# EAGLE design usb (EAGLE 9.0.1)
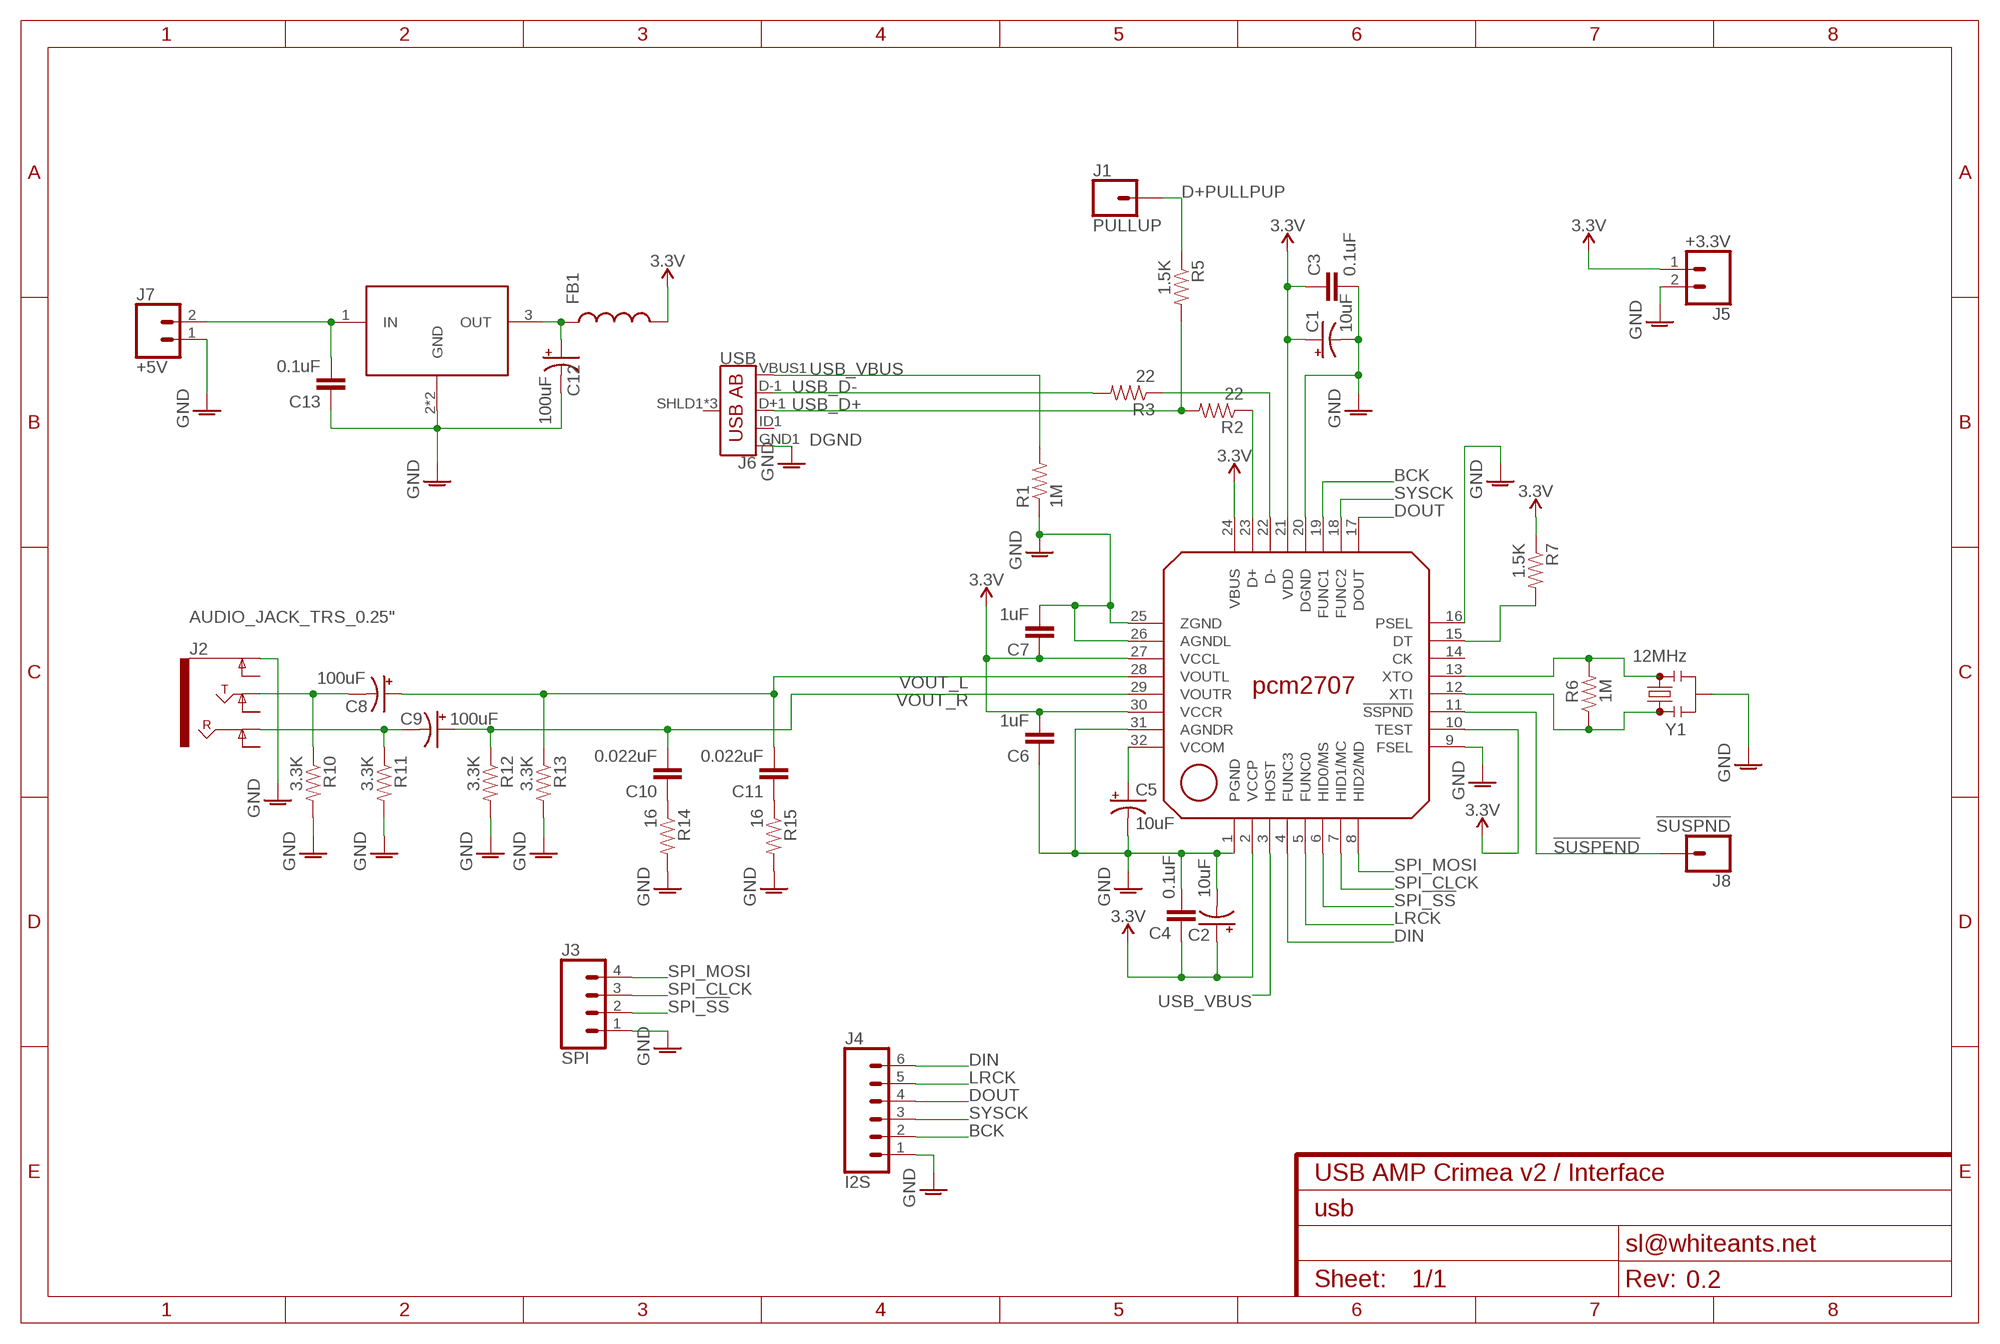
[diagram p0: schematic, sheet 1]
PCM2707_FRAME (FRAME-A4L): CNAME: USB AMP Crimea v2 / Interface; CREVISION: 0.2; DESIGNER: sl@whiteants.net

## Parts
C1  10uF  CAP_POLPTH1  [CPOL-RADIAL-100UF-25V]
C2  10uF  CAP_POLPTH1  [CPOL-RADIAL-100UF-25V]
C3  0.1uF  CAP1206  [1206]
C4  0.1uF  CAP1206  [1206]
C5  10uF  CAP_POLPTH1  [CPOL-RADIAL-100UF-25V]
C6  1uF  CAP1206  [1206]
C7  1uF  CAP1206  [1206]
C8  100uF  CAP_POLPTH1  [CPOL-RADIAL-100UF-25V]
C9  100uF  CAP_POLPTH1  [CPOL-RADIAL-100UF-25V]
C10  0.022uF  CAP1206  [1206]
C11  0.022uF  CAP1206  [1206]
C12  100uF  CAP_POLPTH1  [CPOL-RADIAL-100UF-25V]
C13  0.1uF  CAP1206  [1206]
FB1  INDUCTOR1210  [1210]
J1  PULLUP  CONN_01  [1X01]
J2  AUDIO_JACK_TRS_0.25"  AUDIO_JACK_TRS_0.25"_PTH_RA  [AUDIO_JACK_0.25"_TRS_PTH_RA]
J3  SPI  CONN_04  [1X04]
J4  I2S  CONN_06POLAR  [MOLEX-1X6]
J5  +3.3V  CONN_02LOCK_LONGPADS  [1X02_LOCK_LONGPADS]
J6  USB  USB_AB_SMT  [USB-AB-MICRO-SMD]
J7  +5V  CONN_02LOCK_LONGPADS  [1X02_LOCK_LONGPADS]
J8  !SUSPND!  CONN_01  [1X01]
R1  1M  RESISTOR0805-RES  [0805]
R2  22  RESISTOR0805-RES  [0805]
R3  22  RESISTOR0805-RES  [0805]
R5  1.5K  RESISTOR0805-RES  [0805]
R6  1M  RESISTOR0805-RES  [0805]
R7  1.5K  RESISTOR0805-RES  [0805]
R10  3.3K  RESISTOR0805-RES  [0805]
R11  3.3K  RESISTOR0805-RES  [0805]
R12  3.3K  RESISTOR0805-RES  [0805]
R13  3.3K  RESISTOR0805-RES  [0805]
R14  16  RESISTOR0805-RES  [0805]
R15  16  RESISTOR0805-RES  [0805]
U2  LM3940IMP-3.3  LM3940IMP-3.3/NOPB  [SOT223]
UK1  PCM2707  [TQFP32-0.8-7X7MM]
Y1  12MHz  RESONATORSMD-3.2X1.3  [RESONATOR-SMD-3.2X1.3]

## Nets
3.3V: C1.1(+) C2.1(+) C3.1 C4.1 C6.2 C7.1 FB1.2 J5.1 R7.1 UK1.2(VCCP) UK1.10(TEST) UK1.21(VDD) UK1.24(VBUS) UK1.27(VCCL) UK1.30(VCCR)
!SUSPEND!: J8.1 UK1.11(!SSPND!)
+5V: C13.2 J7.2 U2.1(IN)
BCK: J4.2 UK1.19(FUNC1)
D+PULLPUP: J1.1 R5.1
DGND: C1.2(-) C2.2(-) C3.2 C4.2 C5.2(-) C6.1 C7.2 C12.2(-) C13.1 J2.SLEEVE(EARTH) J3.1 J4.1 J5.2 J6.GND1(GND) J7.1 R1.1 R10.2 R11.2 R12.2 R13.2 R14.2 R15.2 U2.2(GND) U2.4(GND) UK1.1(PGND) UK1.9(FSEL) UK1.16(PSEL) UK1.20(DGND) UK1.25(ZGND) UK1.26(AGNDL) UK1.31(AGNDR) Y1.2 ; supply symbol labelled GND
DIN: J4.6 UK1.4(FUNC3)
DOUT: J4.4 UK1.17(DOUT)
LRCK: J4.5 UK1.5(FUNC0)
N$1: R6.1 UK1.12(XTI) Y1.1
N$2: C12.1(+) FB1.1 U2.3(OUT)
N$3: R6.2 UK1.13(XTO) Y1.3
N$4: R2.1 UK1.23(D+)
N$5: R3.1 UK1.22(D-)
N$6: C5.1(+) UK1.32(VCOM)
N$7: R7.2 UK1.15(DT)
N$10: C8.2(-) J2.TIP R10.1
N$11: C9.2(-) J2.RING R11.1
N$14: C10.1 R14.1
N$15: C11.1 R15.1
SPI_!SS!: J3.2 UK1.6(HID0/MS)
SPI_CLCK: J3.3 UK1.7(HID1/MC)
SPI_MOSI: J3.4 UK1.8(HID2/MD)
SYSCK: J4.3 UK1.18(FUNC2)
USB_D+: J6.D+1(D+) R2.2 R5.2
USB_D-: J6.D-1(D-) R3.2
USB_VBUS: J6.VBUS1(VBUS) R1.2 UK1.3(HOST)
VOUT_L: C8.1(+) C11.2 R13.1 UK1.28(VOUTL)
VOUT_R: C9.1(+) C10.2 R12.1 UK1.29(VOUTR)
Unconnected: J2.RING-NORM J2.SLEEVE-NORM(EARTH-NORM) J2.TIP-NORM J6.ID1(USBID) J6.SHLD1(SHIELD) J6.SHLD2(SHIELD) J6.SHLD3(SHIELD) UK1.14(CK)

## Library data of the parts
C1 C2 C5 C8 C9 C12 = SparkFun-Passives:CAP_POL: Capacitor Polarized These are standard SMD and PTH capacitors. Normally 10uF, 47uF, and 100uF in electrolytic and tantalum varieties. Always verify the external diameter of the through hole cap, it varies with capacity, voltage, and manufacturer. The EIA devices should be standard.
C3 C4 C6 C7 C10 C11 C13 = SparkFun-Passives:CAP: Capacitor Standard 0603 ceramic capacitor, and 0.1" leaded capacitor.
FB1 = SparkFun-Passives:INDUCTOR: Inductors Basic Inductor/Choke - 0603 and 1206. Footprints are not proven and vary greatly between part numbers. INDUCTOR POWER 3.3UH 4.0A SMD 0.197" L x 0.197" W x 0.177" H (5.00mm x 5.00mm x 4.50mm)
J1 J8 = SparkFun-Connectors:CONN_01: Single connection point. Often used as Generic Header-pin footprint for 0.1 inch spaced/style header connections On any of the 0.1 inch spaced packages, you can populate with these: Break Away Headers - Straight <https://www.sparkfun.com/products/116> (PRT-00116) Break Away Male Headers - Right Angle <https://www.sparkfun.com/products/553> (PRT-00553) Female Headers <https://www.sparkfun.com/products/115> (PRT-00115) Break Away Headers - Machine Pin <https://www.sparkfun.com/products/117> (PRT-00117) Break Away Female Headers - Swiss Machine Pin <https://www.sparkfun.com/products/743> (PRT-00743) This device is also useful as a general connection point to wire up your design to another part of your project. Our various solder wires solder well into these plated through hole pads. Hook-Up Wire - Assortment (Stranded, 22 AWG) <https://www.sparkfun.com/products/11375> (PRT-11375) Hook-Up Wire - Assortment (Solid Core, 22 AWG) <https://www.sparkfun.com/products/11367> (PRT-11367) View the entire wire category on our website here <https://www.sparkfun.com/categories/141> Special notes: SMTSO-256-ET is a "flush mount" nut for a 4-40 screw. We mostly use this on specialty testbeds; it is a nice way to connect hardware to your PCB at an adjustable hieght. Also note, the SNAP packages are for using a snappable style connector. We sell a baggie of snaps and they are also used on two LilyPad designs: Snap Assortment - 30 pack (male and female) <https://www.sparkfun.com/products/11347> (DEV-11347) LilyPad Arduino SimpleSnap <https://www.sparkfun.com/products/10941> (DEV-10941) LilyPad SimpleSnap Protoboard <https://www.sparkfun.com/products/10940> (DEV-10940)
J2 = SparkFun-Connectors:AUDIO_JACK_TRS_0.25"_PTH_RA: Audio Jack, 1/4" TRS jack, horizontal, PTH, aka "Phono jack" Find the connector here: Audio Jack - 1/4" Stereo (right angle) <https://www.sparkfun.com/products/11144> (COM-11144) Datasheet <http://cdn.sparkfun.com/datasheets/Components/General/JP-611%20DD.jpg> Note, although the datasheet and physical part are slightly different, this footprint was proven to mate well on the Proto Pedal. This device is used on these SparkFun Products: SparkFun TRS Jack Breakout - 1/4" Stereo <https://www.sparkfun.com/products/13005> (BOB-13005 ) SparkFun Proto Pedal - sorry bad link - product comming soon! <https://www.sparkfun.com/products/13124> (PRT-13124); PROD_ID: CONN-12339; SF_ID: COM-11144
J3 = SparkFun-Connectors:CONN_04: Multi connection point. Often used as Generic Header-pin footprint for 0.1 inch spaced/style header connections On any of the 0.1 inch spaced packages, you can populate with these: Break Away Headers - Straight <https://www.sparkfun.com/products/116> (PRT-00116) Break Away Male Headers - Right Angle <https://www.sparkfun.com/products/553> (PRT-00553) Female Headers <https://www.sparkfun.com/products/115> (PRT-00115) Break Away Headers - Machine Pin <https://www.sparkfun.com/products/117> (PRT-00117) Break Away Female Headers - Swiss Machine Pin <https://www.sparkfun.com/products/743> (PRT-00743) For SCREWTERMINALS and SPRING TERMINALS visit here: Screw Terimnals on SparkFun.com <https://www.sparkfun.com/search/results?term=Screw+Terminals> (5mm/3.5mm/2.54mm spacing) This device is also useful as a general connection point to wire up your design to another part of your project. Our various solder wires solder well into these plated through hole pads. Hook-Up Wire - Assortment (Stranded, 22 AWG) <https://www.sparkfun.com/products/11375> (PRT-11375) Hook-Up Wire - Assortment (Solid Core, 22 AWG) <https://www.sparkfun.com/products/11367> (PRT-11367) View the entire wire category on our website here <https://www.sparkfun.com/categories/141> Special notes: Molex polarized connector foot print use with SKU : PRT-08231 with associated crimp pins and housings. 1MM SMD Version SKU: PRT-10208; PROD_ID: CONN-09696
J4 = SparkFun-Connectors:CONN_06: Multi connection point. Often used as Generic Header-pin footprint for 0.1 inch spaced/style header connections On any of the 0.1 inch spaced packages, you can populate with these: Break Away Headers - Straight <https://www.sparkfun.com/products/116> (PRT-00116) Break Away Male Headers - Right Angle <https://www.sparkfun.com/products/553> (PRT-00553) Female Headers <https://www.sparkfun.com/products/115> (PRT-00115) Break Away Headers - Machine Pin <https://www.sparkfun.com/products/117> (PRT-00117) Break Away Female Headers - Swiss Machine Pin <https://www.sparkfun.com/products/743> (PRT-00743) Arduino Stackable Header - 6 Pin <https://www.sparkfun.com/products/9280> (PRT-09280) For SCREWTERMINALS and SPRING TERMINALS visit here: Screw Terimnals on SparkFun.com <https://www.sparkfun.com/search/results?term=Screw+Terminals> (5mm/3.5mm/2.54mm spacing) This device is also useful as a general connection point to wire up your design to another part of your project. Our various solder wires solder well into these plated through hole pads. Hook-Up Wire - Assortment (Stranded, 22 AWG) <https://www.sparkfun.com/products/11375> (PRT-11375) Hook-Up Wire - Assortment (Solid Core, 22 AWG) <https://www.sparkfun.com/products/11367> (PRT-11367) View the entire wire category on our website here <https://www.sparkfun.com/categories/141>
J5 J7 = SparkFun-Connectors:CONN_02: Multi connection point. Often used as Generic Header-pin footprint for 0.1 inch spaced/style header connections On any of the 0.1 inch spaced packages, you can populate with these: Break Away Headers - Straight <https://www.sparkfun.com/products/116> (PRT-00116) Break Away Male Headers - Right Angle <https://www.sparkfun.com/products/553> (PRT-00553) Female Headers <https://www.sparkfun.com/products/115> (PRT-00115) Break Away Headers - Machine Pin <https://www.sparkfun.com/products/117> (PRT-00117) Break Away Female Headers - Swiss Machine Pin <https://www.sparkfun.com/products/743> (PRT-00743) For SCREWTERMINALS and SPRING TERMINALS visit here: Screw Terimnals on SparkFun.com <https://www.sparkfun.com/search/results?term=Screw+Terminals> (5mm/3.5mm/2.54mm spacing) This device is also useful as a general connection point to wire up your design to another part of your project. Our various solder wires solder well into these plated through hole pads. Hook-Up Wire - Assortment (Stranded, 22 AWG) <https://www.sparkfun.com/products/11375> (PRT-11375) Hook-Up Wire - Assortment (Solid Core, 22 AWG) <https://www.sparkfun.com/products/11367> (PRT-11367) View the entire wire category on our website here <https://www.sparkfun.com/categories/141> Special notes: Molex polarized connector foot print use with: PRT-08233 with associated crimp pins and housings. 2.54_SCREWTERM for use with PRT-10571. 3.5mm Screw Terminal footprints for PRT-08084 5mm Screw Terminal footprints for use with PRT-08432
J6 = SparkFun-Connectors:USB_AB: USB Type AB Micro Connector OTG-compatible. 5 pins, 3 shield pins SparkFun Products: IOIO-OTG <https://www.sparkfun.com/products/13613> SparkFun SAMD21 Mini Breakout <https://www.sparkfun.com/products/13664>; PROD_ID: CONN-11794
R1-R3 R5-R7 R10-R15 = SparkFun-Passives:RESISTOR: Resistor Basic schematic elements and footprints for 0603, 1206, and PTH resistors.
U2 = EduAreaLib:LM3940IMP-3.3/NOPB
UK1 = EduAreaLib:PCM2707; SPICEPREFIX: U
Y1 = SparkFun-Clocks:RESONATOR: Resonators (Generic) Ceramic resonators are clock-generating components, often used to control timing in microcontrollers. They usually have 3 pins: two pins for oscillation, and one pin for ground. Compared to crystals, resonators have worse tolerance, but are usually much cheaper. Plus, they have built-in load capacitors! These devices are used on boards like the Arduino Pro 8MHz <https://www.sparkfun.com/products/11114> and Arduino Pro 16MHz <https://www.sparkfun.com/products/11113>.

## Board
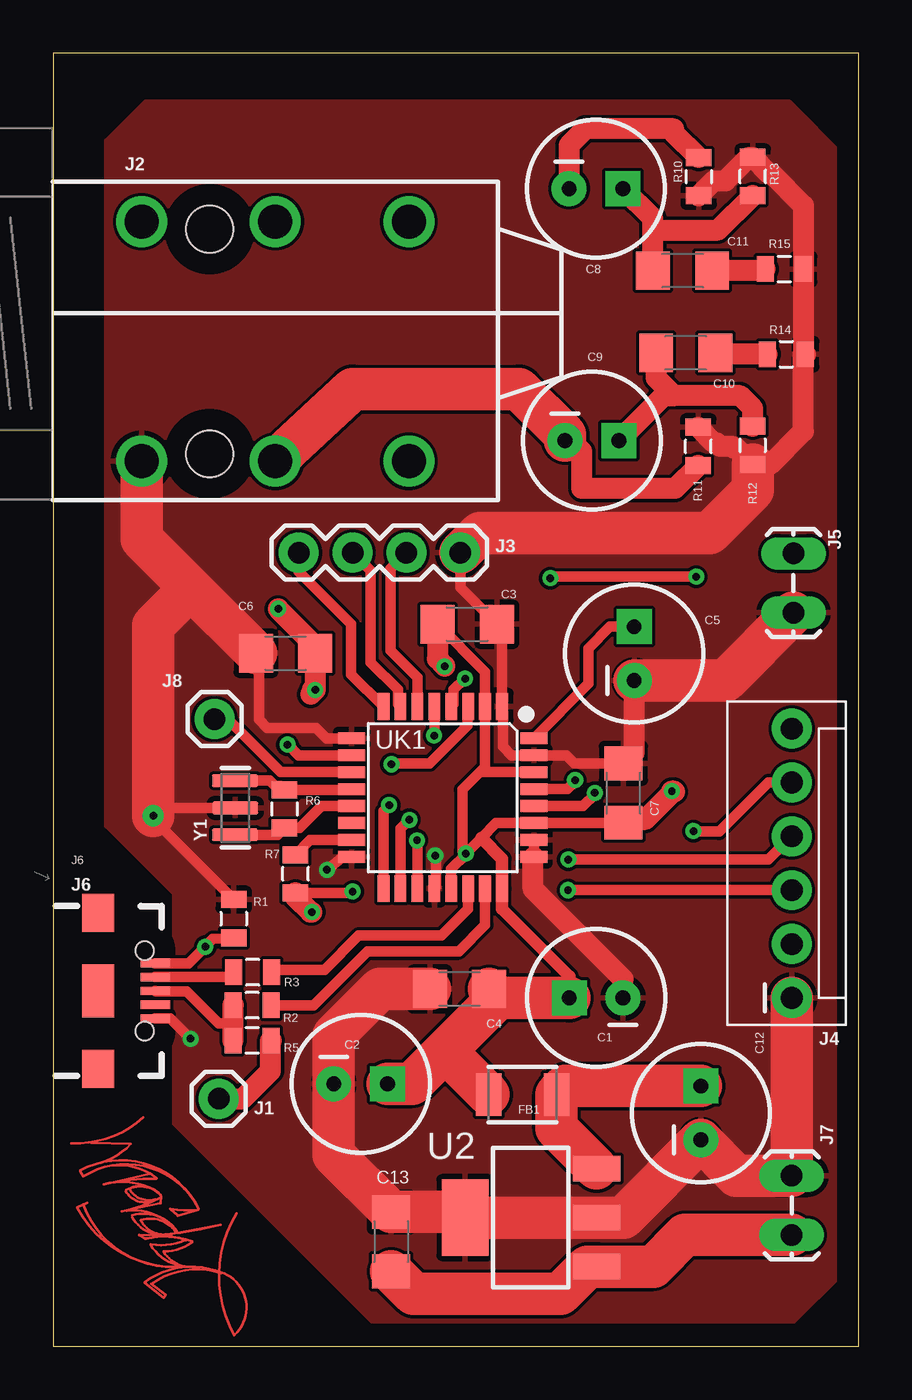
[diagram p1: board, top side]
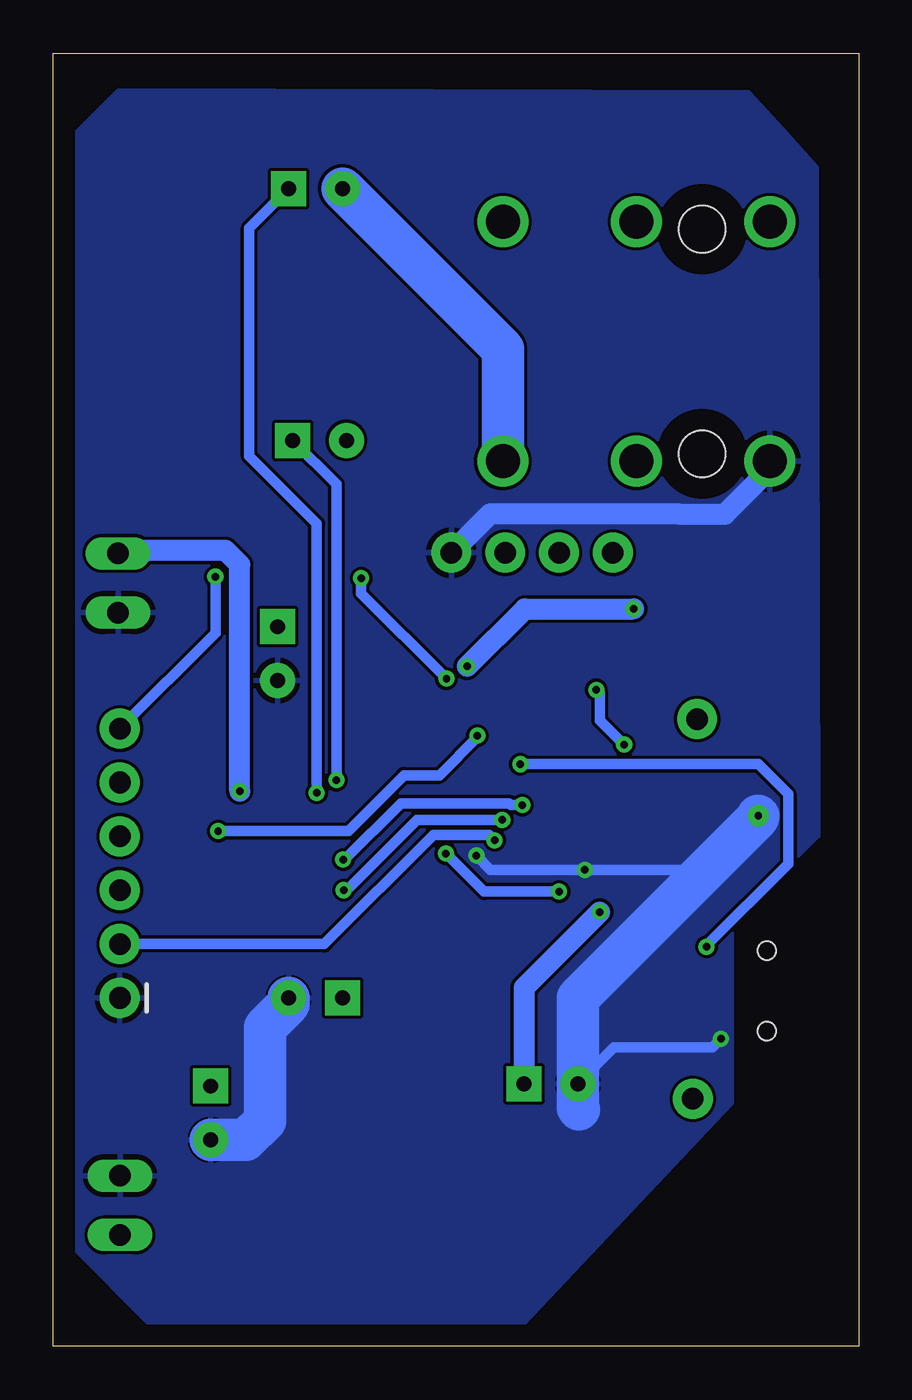
[diagram p2: board, bottom side, seen from below]

Size 38 x 61 mm. Coordinates in mm from the lower left corner, seen from the top.
Outline: 0,0 38,0 38,61 0,61 0,0
Copper layers (1*16): Top 0.035mm / dielectric 1.6mm / Bottom 0.035mm
Design rules "default *": minimum track width 6mil, minimum drill 0.35mm, track to track 6mil, track to pad 6mil, pad to pad 6mil, via to via 6mil, smd to smd 6mil, copper to edge 40mil, drill to drill 6mil, minimum pad ring 10mil, minimum via ring 8mil, stop-mask expansion 4mil, vias tented up to drill 0mil, thermal gap 10mil

### Footprints (pad centres in the part's own frame; a part is rotated, then mirrored left to right if it is on the bottom)
CPOL-RADIAL-100UF-25V = drill 0.7 pad 1.651 square: 1 1.27,0 | drill 0.7 pad 1.651: 2 -1.27,0
1206 = smd 1.6 x 1.8: 1 -1.4,0; 2 1.4,0
1210 = smd 1.2 x 2: 1 -1.6,0; 2 1.6,0
1X01 = drill 1.016 pad 1.88: 1 0,0
AUDIO_JACK_0.25"_TRS_PTH_RA = drill 1.6: RING 10.5,-6.95; RING-NORM 10.5,4.35; SLEEVE 4.2,-6.95; SLEEVE-NORM 4.2,4.35; TIP 16.8,-6.95; TIP-NORM 16.8,4.35 | hole 2.2: 7.4,4; 7.4,-6.6
1X04 = drill 1.016 pad 1.88: 1 0,0; 2 2.54,0; 3 5.08,0; 4 7.62,0
MOLEX-1X6 = drill 1.016 pad 1.88: 1 0,0; 2 2.54,0; 3 5.08,0; 4 7.62,0; 5 10.16,0; 6 12.7,0
1X02_LOCK_LONGPADS = drill 1.016 long: 1 -0.127,0; 2 2.667,0
USB-AB-MICRO-SMD = smd 1.4 x 0.4: D+1 2.7,0; D-1 2.7,0.65; GND1 2.7,-1.3; ID1 2.7,-0.65; VBUS1 2.7,1.3 | smd 1.5 x 1.8: SHLD1 0,-3.68; SHLD2 0,3.68 | smd 1.5 x 2.5: SHLD3 0,0 | hole 0.85: 2.2,1.9; 2.2,-1.9
0805 = smd 0.8 x 1.2: 1 -0.9,0; 2 0.9,0
SOT223 = smd 1.219 x 2.235: 1 -2.311,-3.099; 2 0,-3.099; 3 2.311,-3.099 | smd 3.6 x 2.2: 4 0,3.099
TQFP32-0.8-7X7MM = smd 1.27 x 0.559: 1 -4.293,2.8; 2 -4.293,2; 3 -4.293,1.2; 4 -4.293,0.4; 5 -4.293,-0.4; 6 -4.293,-1.2; 7 -4.293,-2; 8 -4.293,-2.8; 17 4.293,-2.8; 18 4.293,-2; 19 4.293,-1.2; 20 4.293,-0.4; 21 4.293,0.4; 22 4.293,1.2; 23 4.293,2; 24 4.293,2.8 | smd 0.559 x 1.27: 9 -2.8,-4.293; 10 -2,-4.293; 11 -1.2,-4.293; 12 -0.4,-4.293; 13 0.4,-4.293; 14 1.2,-4.293; 15 2,-4.293; 16 2.8,-4.293; 25 2.8,4.293; 26 2,4.293; 27 1.2,4.293; 28 0.4,4.293; 29 -0.4,4.293; 30 -1.2,4.293; 31 -2,4.293; 32 -2.8,4.293
RESONATOR-SMD-3.2X1.3 = smd 0.61 x 2.184: 1 -1.283,-0.006; 2 0,0; 3 1.27,-0.006

### Placement (x,y rotation side)
C1  25.62,16.44 180 top
C2  14.52,12.39 0 top
C3  19.54,34.06 0 top
C4  19.17,16.86 180 top
C5  27.41,32.67 90 top
C6  10.97,32.69 0 top
C7  26.91,26.1 90 top
C8  25.61,54.61 0 top
C9  25.43,42.73 0 top
C10  29.85,46.86 180 top
C11  29.69,50.74 180 top
C12  30.56,11.01 90 top
C13  15.95,4.94 270 top
FB1  22.15,11.88 180 top
J1  7.82,11.68 0 top
J2  -0.02,48.7 0 top
J3  19.21,37.44 180 top
J4  34.85,16.44 90 top
J5  34.93,37.27 270 top
J6  2.13,16.77 0 top
J7  34.84,7.93 270 top
J8  7.62,29.59 0 top
R1  8.53,20.18 270 top
R2  9.4,16.09 180 top
R3  9.41,17.65 180 top
R5  9.39,14.43 180 top
R6  10.92,25.36 270 top
R7  11.44,22.29 90 top
R10  30.46,55.16 270 top
R11  30.43,42.45 90 top
R12  33,42.5 270 top
R13  33,55.18 90 top
R14  34.59,46.79 0 top
R15  34.49,50.81 0 top
U2  22.54,6.08 90 top
U$3  [CRIMEA_TOP]  8.56,3.09 115 top
UK1  18.38,25.88 270 top
Y1  8.59,25.4 270 top

### Tracks (layer width: path | path; a pad name or v marks a point on that pad's centre or on a via)
3.3V  (via drill 0.35)
  Top 0.5: UK1.21 18.78,22.52 19.47,23.21 | 19.47,23.21 v19.47,23.25 20.2,23.98 20.9,24.68 UK1.27 26.89,24.68 C7.1 | C3.1 20.38,31.82 UK1.2 20.38,27.33 20.13,27.08 | R7.1 14.02,21.39 14.13,21.5 | 14.21,21.58 14.13,21.5 | 14.13,21.5 v14.13,21.45 | UK1.30 20.13,27.08 | 20.13,27.08 19.31,26.26 19.31,23.37 19.47,23.21 | v11.06,28.38 11.09,28.38 11.59,27.88 UK1.10
  Top 0.6: 20.2,23.98 21.18,23 UK1.24 21.18,20.63 24.35,17.46 C1.1
  Top 1: v12.37,30.97 C6.2 12.37,33.04 v10.62,34.79 | v12.37,30.97 12.15,30.75 | 12.24,30.97 v12.37,30.97 | C3.1 18.14,32.43 18.47,32.1 v18.47,32.07 | R7.1 11.44,21.19 12.14,20.49 v12.21,20.49 | C7.1 27.07,24.86 27.95,24.86 29.25,26.16 29.32,26.16 29.29,26.19 v29.19,26.19
  Top 2: C1.1 20.99,16.44 | 20.99,16.44 C4.1 | C2.1 16.94,12.39 18.52,13.97 | 18.52,13.97 20.99,16.44 | FB1.2 18.52,13.91 18.52,13.97
  Bottom 0.5: v14.13,21.45 17.67,21.45 v19.47,23.25 | v11.06,28.38 12.21,29.53 12.21,30.83 12.35,30.97 v12.37,30.97
  Bottom 1: v18.47,32.07 15.75,34.79 v10.62,34.79 10.6,34.79 | 15.56,12.61 C2.1 15.79,16.91 v12.21,20.49 | v29.19,26.19 29.19,36.87 29.86,37.54 34.79,37.54 J5.1
!SUSPEND!
  Top 0.5: J8.1 8.24,29.59 10.75,27.08 UK1.11
+5V
  Top 2: J7.2 29.81,5.26 28.32,3.77 U2.1 25.22,3.77 23.93,2.48 17.01,2.48 C13.2
BCK  (via drill 0.35)
  Top 0.5: UK1.19 17.18,23.72 17.28,23.82 17.22,23.82 v17.17,23.87
  Bottom 0.5: v17.17,23.87 17.43,24.13 20.06,24.13 25.21,18.98 J4.2
D+PULLPUP
  Top 1: J1.1 8.95,11.68 10.26,12.99 10.26,14.4 R5.1
DGND  (via drill 0.35, 0.35 pad 1)
  Top 0.5: J6.GND1 5.53,15.47 v6.49,14.51 | UK1.20 18.06,21.67 18.06,23.18 v18.03,23.15 | Y1.2 5.43,25.39 5.07,25.03 | 5.07,25.03 v4.73,25.03 | J3.1 19.21,35.79 C3.2 21.18,33.81 UK1.1 21.23,30.13 21.23,28.29 21.64,27.88 UK1.31 24.22,27.88 24.6,27.5 C7.2 | R1.1 5.07,24.54 5.07,25.03 | UK1.16 13.62,23.06 12.95,22.5 v12.92,22.48 | UK1.9 12.91,28.68 12.41,29.18 10.11,29.18 9.71,29.58 9.71,32.55 C6.1 | UK1.26 UK1.25
  Top 1: R10.2 31.16,54.97 31.72,54.97 32.83,56.08 R13.2 33.75,55.33 33.87,55.33 35.39,53.81 R15.2 35.39,46.88 | 35.39,46.88 R14.2 | 35.39,46.88 35.39,43.16 33.83,41.6 R12.2 32.25,42.35 32.13,42.35 32.03,42.44 31.47,42.44 31.3,42.61 31.18,42.61 R11.2 | C7.2 27.41,28.01 C5.2 | C1.2 26.89,17.33 22.65,21.57 22.65,23.06 UK1.25
  Top 2: C4.2 15.43,16.86 13.24,14.68 C2.2 13.24,9.04 C13.1 19.18,6.34 U2.4 U2.2 26.9,6.08 C12.2 32.24,8.06 J7.1 34.84,15.88 J4.1 | C5.2 31.73,31.41 J5.2 | J3.1 20.14,38.37 30.98,38.37 33,40.39 R12.2 | C6.1 6.5,35.76 | 6.5,35.76 4.18,38.08 J2.SLEEVE | v4.73,25.03 4.73,33.99 6.5,35.76
  Bottom 0.5: v6.49,14.51 6.9,14.1 11.53,14.1 C2.2 | 7.64,22.04 8.07,22.47 v12.92,22.48 17.36,22.48 v18.03,23.15
  Bottom 1: J3.1 17.37,39.28 8.5,39.28 8.47,39.25 6.3,39.25 4.18,41.37 J2.SLEEVE
  Bottom 2: 13.19,11.19 13.24,11.24 C2.2 13.24,16.43 7.64,22.04 4.75,24.93 4.75,25.01 v4.73,25.03 | C12.2 28.91,9.74 28,10.65 28,15.05 26.89,16.16 C1.2
  pour Top: 37.15,3.32 34.96,1.13 34.48,1.13 15.03,1.13 5.68,10.48 5.68,21.32 2.48,24.52 2.48,56.89 4.34,58.75 34.75,58.75 37.31,56.19 37.31,3.5 36.82,3.01
  pour Bottom: 1.95,55.63 1.87,24.05 5.96,19.96 5.96,11.45 15.81,1 33.39,0.94 37.14,4.69 37.14,57.08 34.92,59.3 5.17,59.19 3.55,57.42
DIN  (via drill 0.35)
  Top 0.5: UK1.4 18.9,30.29 18.9,30.98 19.38,31.45 19.38,31.47 19.41,31.5 v19.44,31.5 | v23.46,36.23 23.53,36.3 v30.34,36.3 30.47,36.3
  Bottom 0.5: v19.44,31.5 23.46,35.52 v23.46,36.23 23.46,36.26 | v30.34,36.3 30.34,33.65 J4.6
DOUT  (via drill 0.35)
  Top 0.5: UK1.17 15.58,25.24 v15.86,25.52 v15.86,25.53 | v24.31,22.96 33.75,22.96 J4.4
  Bottom 0.5: v15.86,25.53 16.4,25.53 16.49,25.62 21.59,25.62 24.29,22.92 24.31,22.94 v24.31,22.96
LRCK  (via drill 0.35)
  Top 0.5: J4.5 33.76,26.6 33.75,26.61 31.42,24.28 30.37,24.28 30.34,24.31 v30.21,24.31 | v17.98,28.81 UK1.5
  Bottom 0.5: v30.21,24.31 24.07,24.31 21.45,26.93 19.78,26.93 17.97,28.74 v17.97,28.8 v17.98,28.81
N$1
  Top 0.5: UK1.12 14.06,26.26 R6.1 10.74,26.43 10.48,26.43 10.22,26.68 Y1.1
N$2
  Top 2: C12.1 24.15,12.28 FB1.1 23.75,10.28 U2.3
N$3
  Top 0.5: UK1.13 12.66,25.48 11.64,24.46 R6.2 10.59,24.13 Y1.3
N$4
  Top 0.5: R2.1 12.29,16.09 14.84,18.64 19.14,18.64 20.38,19.88 UK1.23
N$5
  Top 0.5: 10.37,17.71 R3.1 10.42,17.76 12.8,17.76 14.42,19.38 18.33,19.38 19.58,20.63 UK1.22
N$6
  Top 0.5: UK1.32 25.25,31.26 25.25,32.92 26.27,33.95 C5.1
N$7
  Top 0.5: R7.2 12.13,23.88 UK1.15
N$10
  Top 1: R10.1 29.27,57.25 29.27,57.42 25.12,57.42 24.34,56.65 C8.2
  Bottom 2: J2.TIP 16.78,47.05 C8.2
N$11
  Top 1: R11.1 29.34,40.46 24.94,40.46 24.94,42.21 24.16,42.99
  Top 2: J2.RING 14.13,45.16 21.99,45.16 24.16,42.99 C9.2
N$14
  Top 1: R14.1 31.32,46.79 C10.1
N$15
  Top 1: R15.1 33.52,50.74 C11.1
SPI_!SS!
  Top 0.5: UK1.6 17.18,31.56 15.93,32.81 15.93,36.7 J3.2
SPI_CLCK
  Top 0.5: UK1.7 16.27,30.29 16.27,30.98 14.98,32.26 14.98,36.59 J3.3
SPI_MOSI
  Top 0.5: UK1.8 14.07,31.69 14.07,34.06 11.59,36.54 J3.4
SYSCK  (via drill 0.35)
  Top 0.5: UK1.18 16.38,24.43 16.79,24.84 v16.81,24.84 | v24.29,21.52 J4.3
  Bottom 0.5: v16.81,24.84 20.82,24.84 24.18,21.48 24.22,21.52 v24.29,21.52
USB_D+
  Top 0.5: J6.D+1 4.86,16.74 6.31,16.74 7.81,15.24 8.49,15.24
  Top 1: R5.2 8.49,15.24 R2.2
USB_D-
  Top 0.5: J6.D-1 8.28,17.42 R3.2
USB_VBUS  (via drill 0.35)
  Top 0.5: J6.VBUS1 6.4,18.07 v7.18,18.85 7.54,19.21 R1.2 | UK1.3 19.55,30.15 19.55,29.28 18.3,28.03 17.77,27.5 16.04,27.5 16,27.46 v15.96,27.46
  Bottom 0.5: v15.96,27.46 4.74,27.46 3.33,26.05 3.33,22.76 7.2,18.89 7.18,18.87 v7.18,18.85
VOUT_L  (via drill 0.35)
  Top 0.5: UK1.28 25,25.48 25.56,26.04 v25.56,26.11
  Top 1: C11.2 28.29,52.65 | 28.29,52.65 28.29,53.2 C8.1 | 28.29,52.65 31.37,52.65 R13.1
  Bottom 0.5: v25.56,26.11 25.56,38.8 28.74,41.98 28.74,52.75 C8.1
VOUT_R  (via drill 0.35)
  Top 0.5: UK1.29 24.27,26.28 24.59,26.6 24.59,26.67 v24.63,26.71
  Top 1: R12.1 33,44.25 32.41,44.84 29.28,44.84 | C10.2 28.45,45.67 29.28,44.84 | C9.1 28.81,44.84 29.28,44.84
  Bottom 0.5: v24.63,26.71 24.63,40.66 C9.1

### Text on the board
tValues: MOSI | CLCK | !SS! | GND | GND | DIN | LRCK | SYSCK | DOUT | BCK | GND | GND